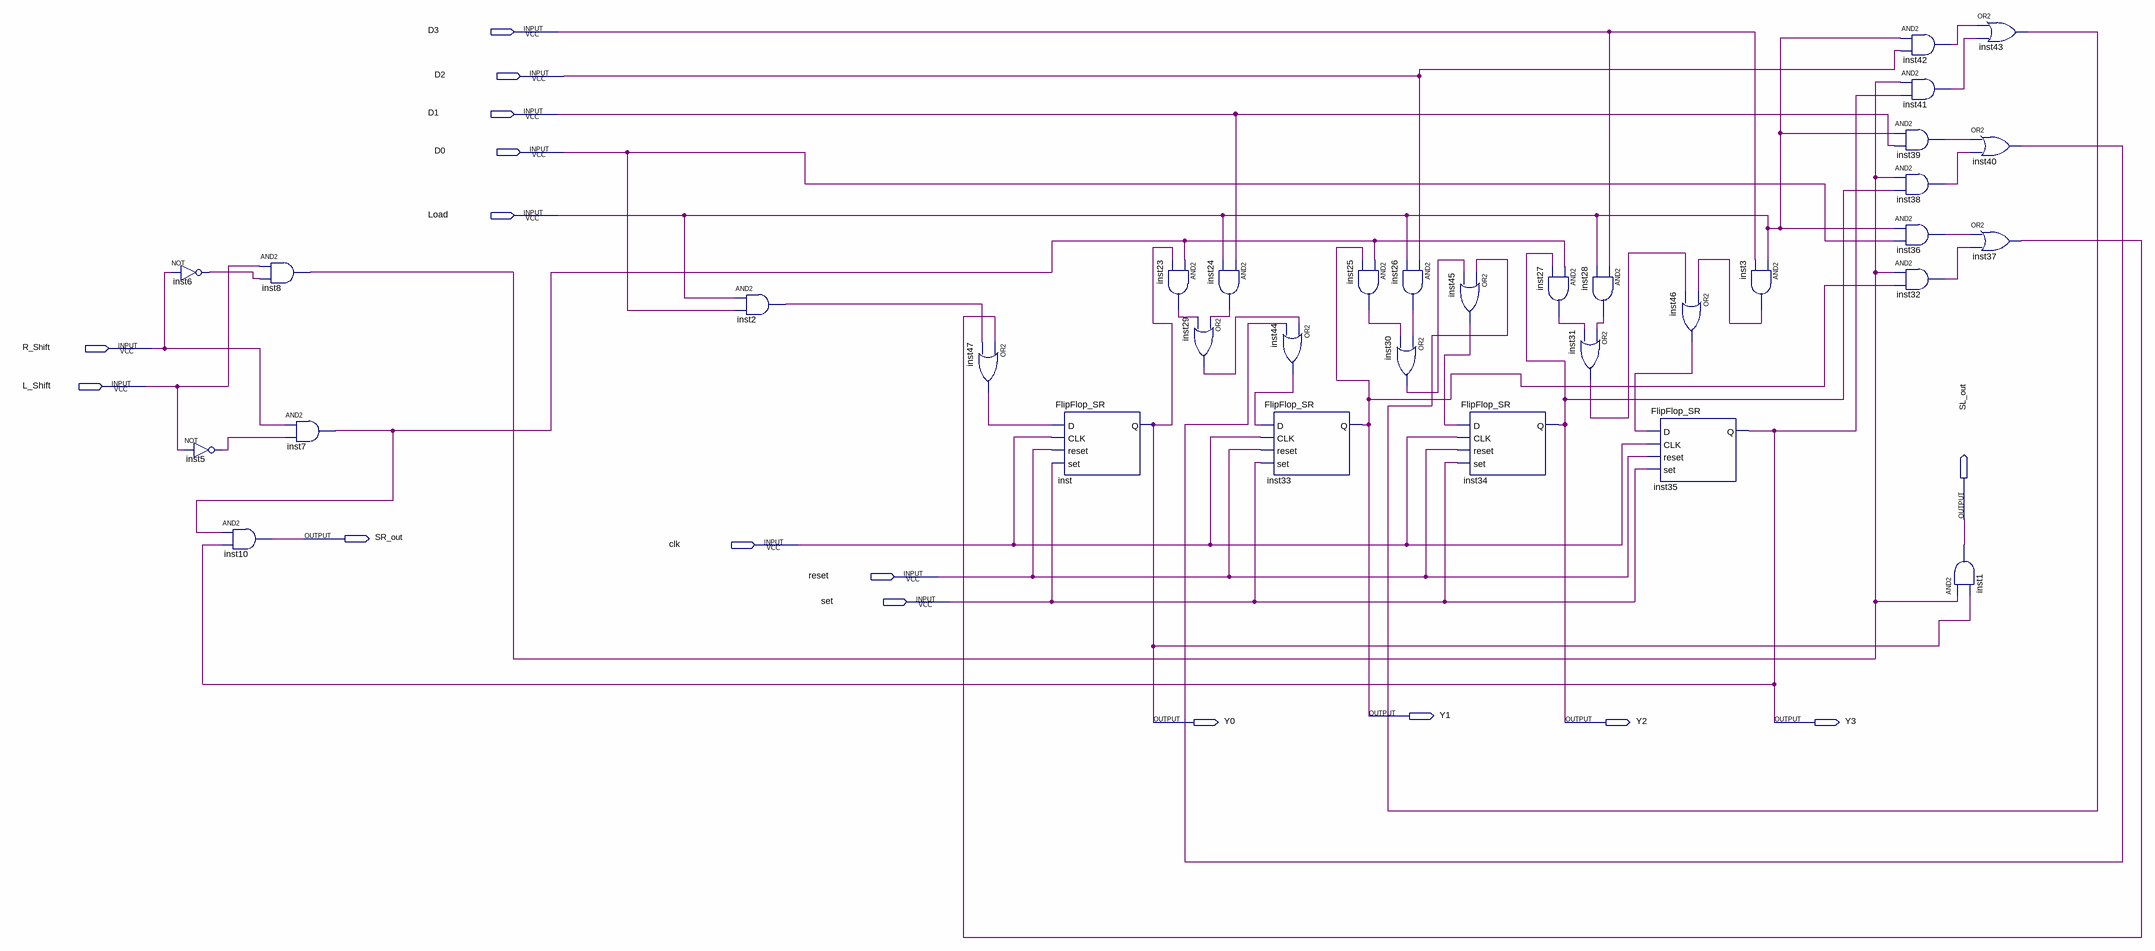
[diagram p0: schematic sheet]
// Quartus schematic LAB_3.bdf as structural Verilog: 34 symbols, 16 pins
module LAB_3 (
  input  D3,
  input  D2,
  input  D1,
  input  D0,
  input  Load,
  input  R_Shift,
  input  L_Shift,
  input  clk,
  input  reset,
  input  set,
  output SL_out,
  output SR_out,
  output Y1,
  output Y0,
  output Y2,
  output Y3
);

  wire inst2_out, inst3_out, inst5_out, inst6_out, inst7_out, inst8_out, inst23_out, inst24_out, inst25_out,
       inst26_out, inst27_out, inst28_out, inst29_out, inst30_out, inst31_out, inst32_out, inst36_out,
       inst37_out, inst38_out, inst39_out, inst40_out, inst41_out, inst42_out, inst43_out, inst44_out,
       inst45_out, inst46_out, inst47_out;

  not inst6 (inst6_out, R_Shift);
  not inst5 (inst5_out, L_Shift);
  and inst8 (inst8_out, L_Shift, inst6_out);
  and inst10 (SR_out, inst7_out, Y3);
  and inst7 (inst7_out, R_Shift, inst5_out);
  and inst2 (inst2_out, Load, D0);
  or inst47 (inst47_out, inst37_out, inst2_out);
  FlipFlop_SR inst (.D(inst47_out), .CLK(clk), .reset(reset), .set(set), .Q(Y0));
  and inst23 (inst23_out, inst7_out, Y0);
  and inst24 (inst24_out, D1, Load);
  or inst29 (inst29_out, inst24_out, inst23_out);
  or inst44 (inst44_out, inst29_out, inst40_out);
  FlipFlop_SR inst33 (.D(inst44_out), .CLK(clk), .reset(reset), .set(set), .Q(Y1));
  and inst25 (inst25_out, inst7_out, Y1);
  and inst26 (inst26_out, D2, Load);
  or inst30 (inst30_out, inst26_out, inst25_out);
  or inst45 (inst45_out, inst43_out, inst30_out);
  FlipFlop_SR inst34 (.D(inst45_out), .CLK(clk), .reset(reset), .set(set), .Q(Y2));
  and inst27 (inst27_out, inst7_out, Y2);
  and inst28 (inst28_out, D3, Load);
  or inst31 (inst31_out, inst28_out, inst27_out);
  or inst46 (inst46_out, inst3_out, inst31_out);
  FlipFlop_SR inst35 (.D(inst46_out), .CLK(clk), .reset(reset), .set(set), .Q(Y3));
  and inst3 (inst3_out, Load, D3);
  and inst42 (inst42_out, Load, D2);
  and inst41 (inst41_out, inst8_out, Y3);
  and inst39 (inst39_out, Load, D1);
  and inst38 (inst38_out, inst8_out, Y2);
  and inst36 (inst36_out, Load, D0);
  and inst32 (inst32_out, inst8_out, Y1);
  or inst43 (inst43_out, inst42_out, inst41_out);
  or inst40 (inst40_out, inst39_out, inst38_out);
  or inst37 (inst37_out, inst36_out, inst32_out);
  and inst1 (SL_out, inst8_out, Y0);
endmodule
